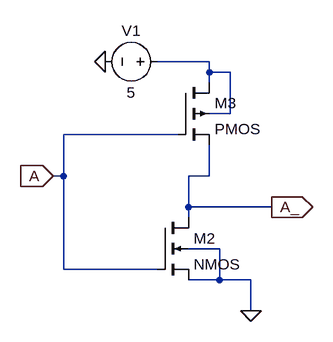
[diagram p0: schematic INVERT.asc]
INVERT.asc, the LTspice schematic file:
Version 4
SHEET 1 880 680
WIRE 192 -48 112 -48
WIRE 192 -32 192 -48
WIRE 224 -32 192 -32
WIRE 192 -16 192 -32
WIRE 224 32 224 -32
WIRE 224 32 192 32
WIRE 144 64 -32 64
WIRE -32 128 -32 64
WIRE -32 128 -48 128
WIRE 192 128 192 80
WIRE 192 128 160 128
WIRE 160 176 160 128
WIRE 288 176 160 176
WIRE 160 192 160 176
WIRE 208 240 160 240
WIRE -32 272 -32 128
WIRE 112 272 -32 272
WIRE 208 288 208 240
WIRE 208 288 160 288
WIRE 256 288 208 288
WIRE 256 336 256 288
FLAG 256 336 0
FLAG 32 -48 0
FLAG -48 128 A
IOPIN -48 128 In
FLAG 288 176 A_
IOPIN 288 176 Out
SYMBOL nmos4 112 192 R0
SYMATTR InstName M2
SYMBOL pmos4 144 -16 R0
SYMATTR InstName M3
SYMBOL voltage 128 -48 R90
WINDOW 0 -32 56 VBottom 2
WINDOW 3 32 56 VTop 2
WINDOW 123 0 0 Left 0
WINDOW 39 0 0 Left 0
SYMATTR InstName V1
SYMATTR Value 5

The netlist it stands for:
* INVERT.asc
M2 A_ A 0 0 NMOS
M3 N001 A A_ N001 PMOS
V1 N001 0 5
.model NMOS NMOS
.model PMOS PMOS
.lib standard.mos
.backanno
.end